# EAGLE design IrDA Contador v1.0 (EAGLE 7.5.0)
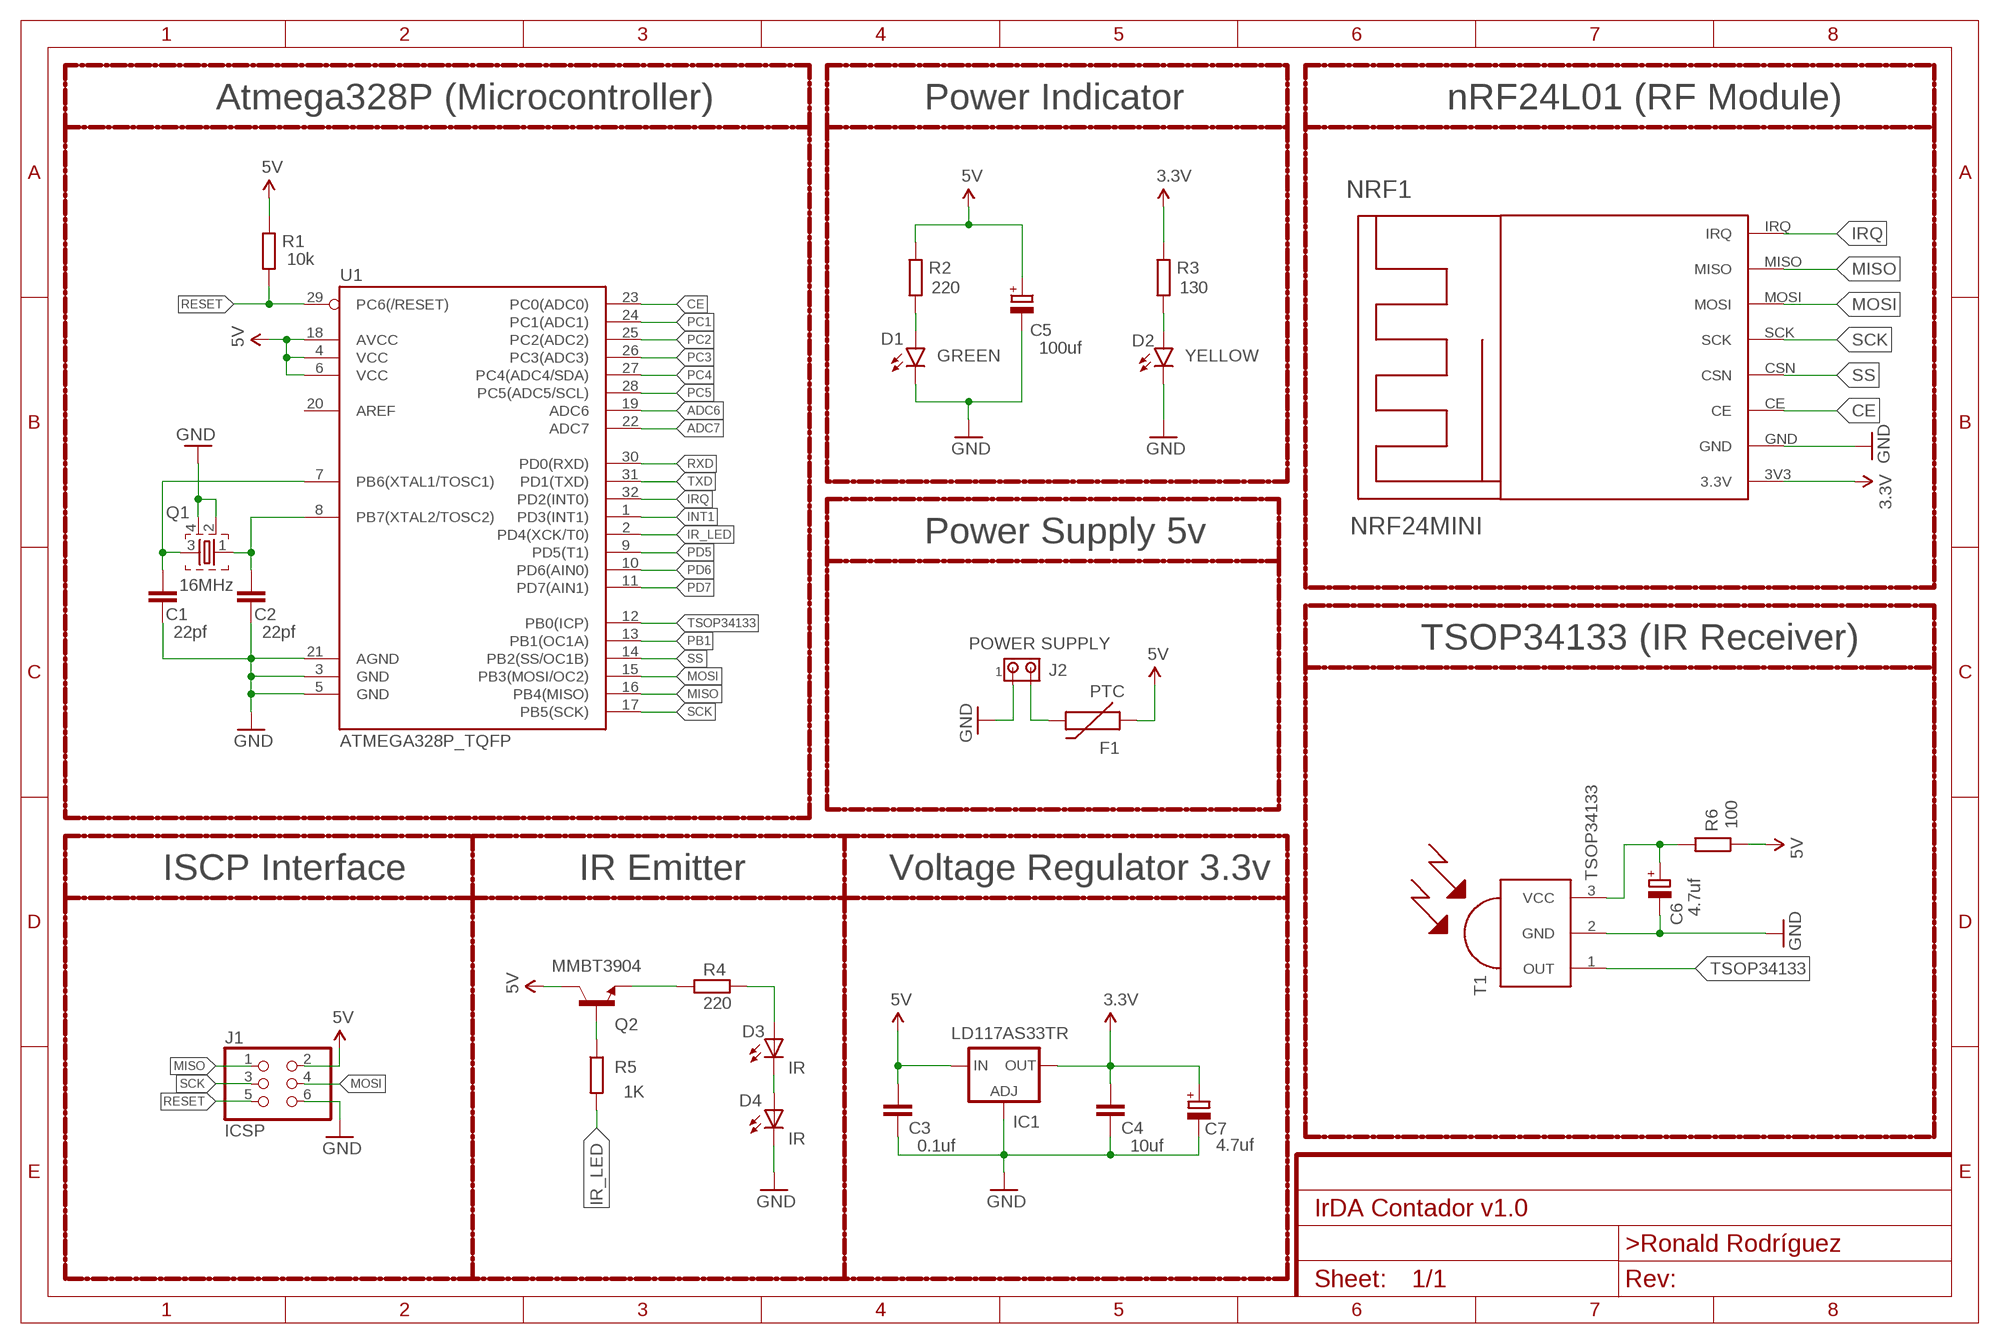
[diagram p0: schematic, sheet 1]

## Parts
C1  22pf  C-EUC0603  [C0603]
C2  22pf  C-EUC0603  [C0603]
C3  0.1uf  C-EUC0603  [C0603]
C4  10uf  C-EUC0603  [C0603]
C5  100uf  CPOL-EU153CLV-0605  [153CLV-0605]
C6  4.7uf  CPOL-EUSMCA  [SMC_A]
C7  4.7uf  CPOL-EUSMCA  [SMC_A]
D1  GREEN  LED-BLUE0603  [LED-0603]
D2  YELLOW  LED-GREEN0603  [LED-0603]
D3  IR  LED5MM  [LED5MM]
D4  IR  LED5MM  [LED5MM]
F1  PTC  PTC0603  [0603]
IC1  LD117AS33TR  [SOT223]
J1  ICSP  PINHD-2X3  [2X03]
J2  POWER SUPPLY  MTA02-156  [1X2MTA]
NRF1  NRF24MINI  [NRF24MINI]
Q1  16MHz  FA-20H  [FA-20H]
Q2  MMBT3904  TRANSISTOR_NPNMMBT2222A  [SOT23-3]
R1  10k  R-EU_R0603  [R0603]
R2  220  R-EU_R0603  [R0603]
R3  130  R-EU_R0603  [R0603]
R4  220  R-EU_R0603  [R0603]
R5  1K  R-EU_R0603  [R0603]
R6  100  R-EU_R0603  [R0603]
T1  TSOP34133  [TSOP34133]
U1  ATMEGA328P_TQFP  [TQFP32-08]

## Nets
3.3V: C4.2 C7.+ IC1.4(OUT) NRF1.3V3(3.3V) R3.2
5V: C3.2 C5.+ F1.1 IC1.3(IN) J1.2 Q2.3(C) R1.2 R2.2 R6.1 U1.4(VCC) U1.6(VCC) U1.18(AVCC)
ADC6: U1.19(ADC6)
ADC7: U1.22(ADC7)
CE: NRF1.CE U1.23(PC0(ADC0))
GND: C1.1 C2.1 C3.1 C4.1 C5.- C6.- C7.- D1.C D2.C D4.K(C) IC1.1(ADJ) J1.6 J2.1 NRF1.GND Q1.2 Q1.4 T1.2(GND) U1.3(GND) U1.5(GND) U1.21(AGND)
INT1: U1.1(PD3(INT1))
IR_LED: R5.2 U1.2(PD4(XCK/T0))
IRQ: NRF1.IRQ U1.32(PD2(INT0))
MISO: J1.1 NRF1.MISO U1.16(PB4(MISO))
MOSI: J1.4 NRF1.MOSI U1.15(PB3(MOSI/OC2))
N$1: D2.A R3.1
N$2: C1.2 Q1.3 U1.7(PB6(XTAL1/TOSC1))
N$3: C2.2 Q1.1 U1.8(PB7(XTAL2/TOSC2))
N$4: D1.A R2.1
N$5: Q2.2(E) R4.2
N$6: D3.A R4.1
N$7: D3.K(C) D4.A
N$8: C6.+ R6.2 T1.3(VCC)
N$9: F1.2 J2.2
N$10: Q2.1(B) R5.1
PB1: U1.13(PB1(OC1A))
PC1: U1.24(PC1(ADC1))
PC2: U1.25(PC2(ADC2))
PC3: U1.26(PC3(ADC3))
PC4: U1.27(PC4(ADC4/SDA))
PC5: U1.28(PC5(ADC5/SCL))
PD5: U1.9(PD5(T1))
PD6: U1.10(PD6(AIN0))
PD7: U1.11(PD7(AIN1))
RESET: J1.5 R1.1 U1.29(PC6(/RESET))
RXD: U1.30(PD0(RXD))
SCK: J1.3 NRF1.SCK U1.17(PB5(SCK))
SS: NRF1.CSN U1.14(PB2(SS/OC1B))
TSOP34133: T1.1(OUT) U1.12(PB0(ICP))
TXD: U1.31(PD1(TXD))
Unconnected: U1.20(AREF)

## Notes on the sheet
- Atmega328P (Microcontroller) | Power Indicator | nRF24L01 (RF Module)
- Power Supply 5v
- TSOP34133 (IR Receiver)
- ISCP Interface | IR Emitter | Voltage Regulator 3.3v

## Library data of the parts
C1-C4 = rcl:C-EU: CAPACITOR, European symbol
C5 = rcl:CPOL-EU: POLARIZED CAPACITOR, European symbol
C6 C7 = resistor:CPOL-EU: POLARIZED CAPACITOR, European symbol
D1 = SparkFun-LED:LED-BLUE: Blue LEDs for production use Various blue LEDs stocked by SparkFun production 0603 - DIO-08575 Rebel - DIO-09553 1206 - DIO-09911; PROD_ID: DIO-08575; VALUE: BLUE
D2 = SparkFun-LED:LED-GREEN: Various green LEDs Green LEDs used in SFE Production 0603- DIO-00821 LARGE- DIO-00862 LILYPAD- DIO-09910; PROD_ID: DIO-00821; VALUE: GREEN
D3 D4 = led:LED: LED OSRAM: - CHIPLED LG R971, LG N971, LY N971, LG Q971, LY Q971, LO R971, LY R971 LH N974, LH R974 LS Q976, LO Q976, LY Q976 LO Q996 - Hyper CHIPLED LW Q18S LB Q993, LB Q99A, LB R99A - SideLED LS A670, LO A670, LY A670, LG A670, LP A670 LB A673, LV A673, LT A673, LW A673 LH A674 LY A675 LS A676, LA A676, LO A676, LY A676, LW A676 LS A679, LY A679, LG A679 - Hyper Micro SIDELED® LS Y876, LA Y876, LO Y876, LY Y876 LT Y87S - SmartLED LW L88C, LW L88S LB L89C, LB L89S, LG L890 LS L89K, LO L89K, LY L89K LS L896, LA L896, LO L896, LY L896 - TOPLED LS T670, LO T670, LY T670, LG T670, LP T670 LSG T670, LSP T670, LSY T670, LOP T670, LYG T670 LG T671, LOG T671, LSG T671 LB T673, LV T673, LT T673, LW T673 LH T674 LS T676, LA T676, LO T676, LY T676, LB T676, LH T676, LSB T676, LW T676 LB T67C, LV T67C, LT T67C, LS T67K, LO T67K, LY T67K, LW E67C LS E67B, LA E67B, LO E67B, LY E67B, LB E67C, LV E67C, LT E67C LW T67C LS T679, LY T679, LG T679 LS T770, LO T770, LY T770, LG T770, LP T770 LB T773, LV T773, LT T773, LW T773 LH T774 LS E675, LA E675, LY E675, LS T675 LS T776, LA T776, LO T776, LY T776, LB T776 LHGB T686 LT T68C, LB T68C - Hyper Mini TOPLED® LB M676 - Mini TOPLED Santana® LG M470 LS M47K, LO M47K, LY M47K Source: http://www.osram.convergy.de LUXEON: - LUMILED® LXK2-PW12-R00, LXK2-PW12-S00, LXK2-PW14-U00, LXK2-PW14-V00 LXK2-PM12-R00, LXK2-PM12-S00, LXK2-PM14-U00 LXK2-PE12-Q00, LXK2-PE12-R00, LXK2-PE12-S00, LXK2-PE14-T00, LXK2-PE14-U00 LXK2-PB12-K00, LXK2-PB12-L00, LXK2-PB12-M00, LXK2-PB14-N00, LXK2-PB14-P00, LXK2-PB14-Q00 LXK2-PR12-L00, LXK2-PR12-M00, LXK2-PR14-Q00, LXK2-PR14-R00 LXK2-PD12-Q00, LXK2-PD12-R00, LXK2-PD12-S00 LXK2-PH12-R00, LXK2-PH12-S00 LXK2-PL12-P00, LXK2-PL12-Q00, LXK2-PL12-R00 Source: www.luxeon.com KINGBRIGHT: KA-3528ASYC Source: www.kingbright.com
F1 = SparkFun-PowerIC:PTC: Resettable Fuse PTC Resettable Fuse. Spark Fun Electronics SKU : COM-08357
IC1 = v-reg:LD117A?*: Low drop fixed and adjustable positive voltage regulators 1 A Source: http://www.st.com/stonline/products/literature/ds/7194/ld1117axx.pdf
J1 = SparkFun-Connectors:PINHD-2X3: PIN HEADER
J2 = con-amp:MTA02-156: AMP connector
NRF1 = nrf24mini:NRF24MINI
Q1 = crystal:FA-: MHz RANGE CRYSTAL UNIT Source: Epson Toyocom
Q2 = SparkFun-DiscreteSemi:TRANSISTOR_NPN: Generic NPN BJT MMBT2222A - TRANS-08049 (SOT-23, 1A 40V) MPSA42 - TRANS-09116 (SOT-23, 500mA 300V) MMBT5088LT1G - TRANS-11160 (SOT-23, 50 mA 30V) BC547 - COM-08928 <http://www.sparkfun.com/products/8928> (TO-92 45V 100mA) (1.Collector 2.Base 3.Emitter) 2N3904 - COM-00521 <http://www.sparkfun.com/products/521> (TO-92 40V 200mA) (1.Emitter 2.Base 3.Collector) P2N2222A - COM-12852 <http://www.sparkfun.com/products/12852> (TO-92 40V 600mA) (1.Collector 2.Base 3.Emitter); PROD_ID: TRANS-08049; VALUE: MMBT2222A
R1-R6 = rcl:R-EU_: RESISTOR, European symbol
T1 = tsop34133:TSOP34133: IR receiver modules for infrared remote control systems
U1 = SparkFun-DigitalIC:ATMEGA328P_TQFP; PROD_ID: IC-09069

## Board
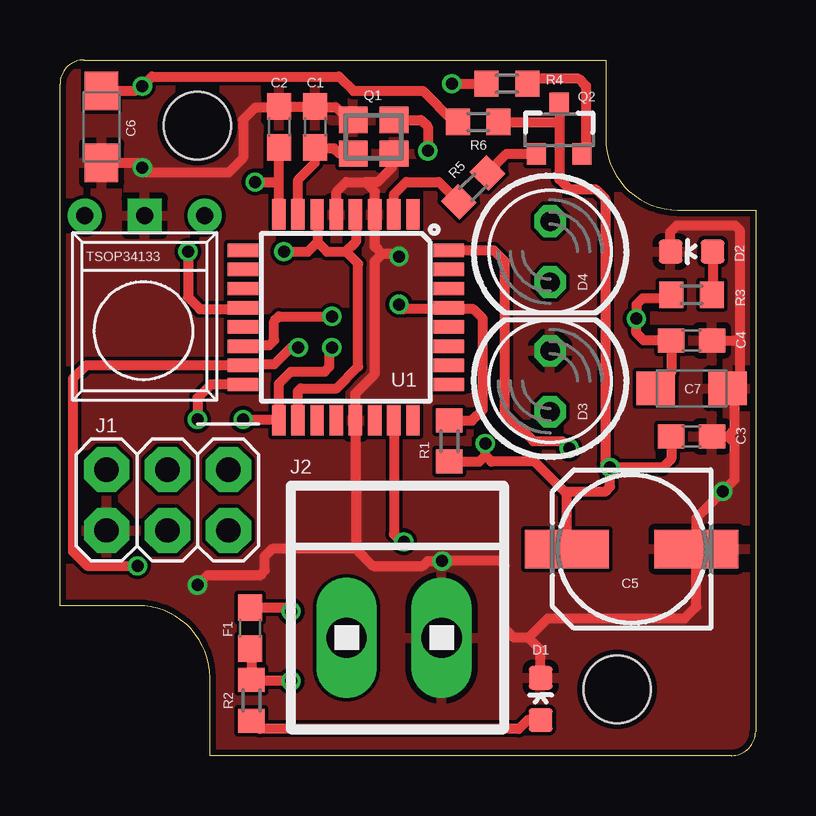
[diagram p1: board, top side]
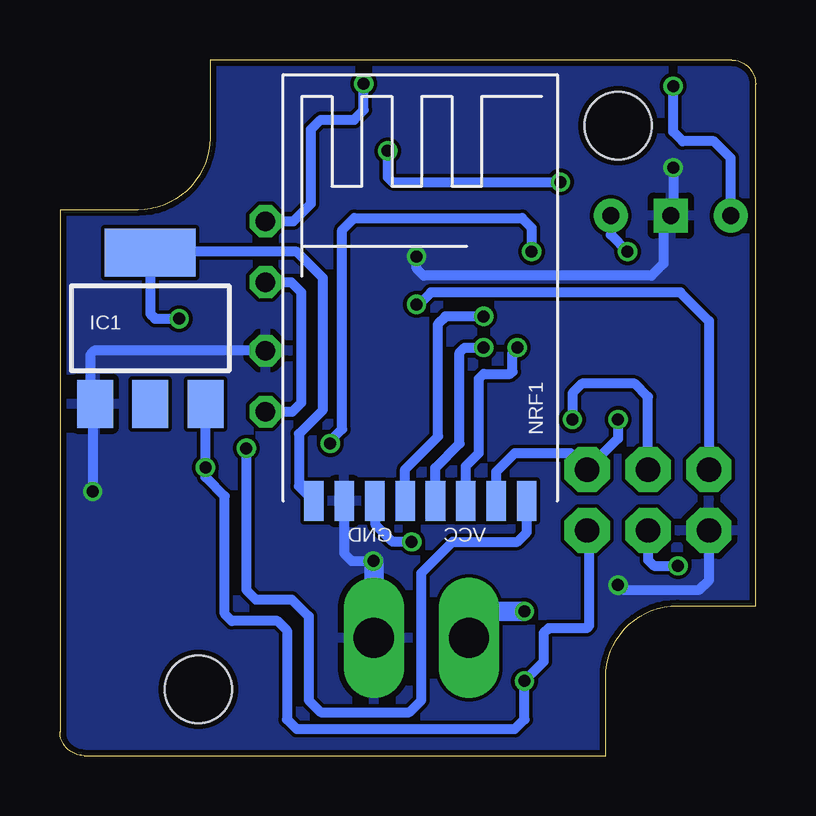
[diagram p2: board, bottom side, seen from below]

Size 29 x 29 mm. Coordinates in mm from the lower left corner, seen from the top.
Outline: 22.75,29 22.75,25.75 arc90 25.75,22.75 29,22.75 29,1 arc-90 28,0 6.25,0 6.25,3.25 arc90 3.25,6.25 0,6.25 0,28 arc-90 1,29 22.75,29
Copper layers (1*16): Top 0.035mm / dielectric 1.5mm / Bottom 0.035mm
Design rules "SeeedStudio_2layer_DRU": minimum track width 6mil, minimum drill 12mil, track to track 6mil, track to pad 6mil, pad to pad 6mil, via to via 6mil, smd to smd 0mil, copper to edge 10mil, drill to drill 10mil, minimum pad ring 10mil, minimum via ring 6mil, stop-mask expansion 2mil, vias tented up to drill 100mil, thermal gap 10mil
Holes 2.8 mm at 5.73,26.26 23.23,2.76

### Footprints (pad centres in the part's own frame; a part is rotated, then mirrored left to right if it is on the bottom)
C0603 = smd 1.1 x 1: 1 -0.85,0; 2 0.85,0
153CLV-0605 = smd 3.5 x 1.6: + 2.7,0; - -2.7,0
SMC_A = smd 1.6 x 1.4: + -1.5,0; - 1.5,0
LED-0603 = smd 1 x 1: A 0,-0.877; C 0,0.877
LED5MM = drill 0.813 octagon: A -1.27,0; K 1.27,0
0603 = smd 1.1 x 1: 1 -0.85,0; 2 0.85,0
SOT223 = smd 1.5 x 2: 1 -2.3,-3.15; 2 0,-3.15; 3 2.3,-3.15 | smd 3.8 x 2: 4 0,3.15
2X03 = drill 1.016 pad 1.88 octagon: 1 -2.54,-1.27; 2 -2.54,1.27; 3 0,-1.27; 4 0,1.27; 5 2.54,-1.27; 6 2.54,1.27
1X2MTA = drill 1.676 long: 1 1.981,0; 2 -1.981,0
NRF24MINI = smd 1.676 x 0.813: 3V3 0,8.89; CE 0,6.35; CSN 0,5.08; GND 0,7.62; IRQ 0,0; MISO 0,1.27; MOSI 0,2.54; SCK 0,3.81
FA-20H = smd 1.2 x 1.1: 1 -0.85,-0.7; 2 0.85,-0.7; 3 0.85,0.7; 4 -0.85,0.7
SOT23-3 = smd 0.8 x 0.9: 1 -0.95,-1; 2 0.95,-1; 3 0,1.1
R0603 = smd 1 x 1.1: 1 -0.85,0; 2 0.85,0
TSOP34133 = drill 0.7 pad 1.422: 1 -2.5,-4.8; 3 2.5,-4.8 | drill 0.7 pad 1.422 square: 2 0,-4.8
TQFP32-08 = smd 1.27 x 0.559: 1 -4.293,2.8; 2 -4.293,2; 3 -4.293,1.2; 4 -4.293,0.4; 5 -4.293,-0.4; 6 -4.293,-1.2; 7 -4.293,-2; 8 -4.293,-2.8; 17 4.293,-2.8; 18 4.293,-2; 19 4.293,-1.2; 20 4.293,-0.4; 21 4.293,0.4; 22 4.293,1.2; 23 4.293,2; 24 4.293,2.8 | smd 0.559 x 1.27: 9 -2.8,-4.293; 10 -2,-4.293; 11 -1.2,-4.293; 12 -0.4,-4.293; 13 0.4,-4.293; 14 1.2,-4.293; 15 2,-4.293; 16 2.8,-4.293; 25 2.8,4.293; 26 2,4.293; 27 1.2,4.293; 28 0.4,4.293; 29 -0.4,4.293; 30 -1.2,4.293; 31 -2,4.293; 32 -2.8,4.293

### Placement (x,y rotation side)
C1  10.63,26.21 270 top
C2  9.13,26.21 270 top
C3  26.33,13.31 180 top
C4  26.33,17.31 180 top
C5  23.83,8.61 180 top
C6  1.73,26.21 270 top
C7  26.33,15.31 0 top
D1  20.04,2.36 0 top
D2  26.33,21.01 90 top
D3  20.43,21.01 270 top
D4  20.43,15.61 90 top
F1  7.93,5.31 90 top
IC1  25.23,17.81 0 bottom
J1  4.48,10.65 180 top
J2  13.93,4.91 0 top
NRF1  9.53,10.61 90 bottom
Q1  13.08,25.79 180 top
Q2  20.81,26.09 0 top
R1  16.23,13.11 270 top
R2  7.98,2.3 90 top
R3  26.33,19.21 180 top
R4  18.63,28.01 0 top
R5  17.22,23.69 225 top
R6  17.43,26.41 180 top
T1  3.53,17.71 180 top
U1  11.92,18.27 270 top

### Tracks (layer width: path | path; a pad name or v marks a point on that pad's centre or on a via)
3.3V  (via drill 0.5)
  Top 0.406: R3.2 25.43,19.06 24.28,19.06 24.03,18.81 v24.03,18.21 24.03,17.61 24.33,17.31 C4.2 25.48,15.96 C7.+
  Bottom 0.406: NRF1.3V3 19.03,11.22 19.03,13.41 18.03,14.41 18.03,19.91 19.13,21.01 24.98,21.01 IC1.4 25.23,18.41 25.03,18.21 v24.03,18.21
5V  (via drill 0.5)
  Top 0.406: U1.4 12.33,21.41 11.93,21.01 | 21.03,11.01 22.73,11.01 22.93,11.21 v22.93,12.01 | C3.2 25.48,12.36 25.13,12.01 v22.93,12.01 | Q2.3 20.81,26.41 | 20.81,26.41 20.81,24.03 21.23,23.61 22.33,23.61 22.73,23.21 22.73,12.21 v22.93,12.01 | U1.18 9.92,15.2 10.03,15.31 11.53,15.31 12.43,16.21 12.43,20.51 11.93,21.01 | 21.03,11.01 19.78,12.26 17.98,12.26 17.73,12.51 | C5.+ 21.13,10.91 21.03,11.01 | R1.2 17.48,12.26 17.73,12.51 | 17.73,12.51 v17.73,13.01 | 7.93,3.3 R2.2 | F1.1 7.98,4.41 R2.2 | 8.04,3.31 R2.2 | 9.13,21.01 v9.33,21.01 10.33,21.01 10.73,21.41 | U1.6 10.73,21.41 | 10.73,21.41 11.13,21.01 11.93,21.01 | R6.1 20.81,26.41 | v9.63,3.11 8.03,3.11 R2.2
  Bottom 0.406: IC1.3 v22.93,12.01 22.93,11.61 22.13,10.81 22.13,5.91 21.83,5.61 19.93,5.61 19.53,5.21 19.53,1.51 19.13,1.11 10.03,1.11 9.63,1.51 v9.63,3.11 8.83,3.91 8.83,5.11 8.63,5.31 7.03,5.31 6.93,5.41 6.93,9.3 J1.2 | v17.73,13.01 17.73,13.11 17.23,13.61 17.23,21.91 16.73,22.41 9.73,22.41 9.33,22.01 v9.33,21.01
CE  (via drill 0.5)
  Top 0.406: 13.93,13.99 U1.23 13.92,9.22 14.23,8.91 v14.33,8.91
  Bottom 0.406: v14.33,8.91 15.13,8.91 15.83,9.61 15.83,10.56 NRF1.CE
GND  (via drill 0.5)
  Top 0.406: D2.C 25.46,21.83 25.73,22.11 28.13,22.11 28.33,21.91 28.33,17.31 | 12.33,8.61 12.33,8.81 U1.21 12.32,15.1 13.13,15.91 13.13,20.61 13.43,20.91 | 12.33,8.61 13.03,7.91 15.13,7.91 15.33,8.11 v15.93,8.11 18.33,8.11 18.53,7.91 18.53,5.31 18.93,4.92 19.54,4.92 | 19.54,4.92 20.33,5.71 26.03,5.71 26.53,6.21 C5.- 26.53,9.91 v27.63,11.01 28.13,11.51 28.13,13.01 27.83,13.31 | C6.- 3.23,24.71 v3.43,24.51 3.63,24.31 7.03,24.31 7.63,24.91 7.63,26.51 8.13,27.01 9.08,27.01 C2.1 C1.1 10.68,27.01 11.53,27.01 12.05,26.49 Q1.2 | D1.C 20.04,4.42 19.54,4.92 | 12.33,8.61 8.83,8.61 8.53,8.31 8.53,7.71 8.33,7.51 6.13,7.51 v5.73,7.11 | v14.13,20.81 14.03,20.91 13.43,20.91 | U1.5 11.53,22.58 11.53,23.51 11.93,23.91 12.73,23.91 | 12.73,23.91 13.12,23.52 U1.3 13.13,21.21 13.43,20.91 | 12.73,23.91 13.23,23.91 13.83,24.51 13.83,25 Q1.4 | 28.33,17.31 28.33,15.81 C7.- 28.13,15.01 28.13,13.61 27.83,13.31 | C3.1 27.83,13.31 | C4.1 28.33,17.31
  Bottom 0.406: v27.63,11.01 27.63,14.36 IC1.1 27.73,14.66 27.73,16.71 27.56,16.88 D4.K | NRF1.GND 17.15,8.43 16.83,8.11 v15.93,8.11 15.91,8.09 | v3.43,24.51 3.43,22.61 T1.2 3.83,22.21 3.83,20.51 4.33,20.01 13.83,20.01 14.13,20.31 v14.13,20.81 | v5.73,7.11 5.53,6.91 2.33,6.91 1.93,7.31 J1.6
  Bottom 0.813: J2.1 15.91,8.09
  pour Bottom: 0.93,29.01 22.73,29.01 22.73,28.01 22.73,25.81 22.73,25.61 arc90 25.53,22.81 28.93,22.81 28.93,1.21 arc-90 27.73,0.01 6.23,0.01 6.23,3.21 arc90 3.13,6.31 0.03,6.31 -0.07,6.31 -0.07,28.01 arc-90
  pour Top: 0.93,29.01 22.73,29.01 22.73,25.81 arc90 25.73,22.81 29.03,22.81 29.03,1.01 arc-90 28.03,0.01 6.23,0.01 6.23,3.31 arc90 3.33,6.21 0.03,6.21 0.03,28.11 arc-90
IR_LED
  Top 0.406: U1.2 13.93,22.58 13.93,23.41 14.43,23.91 15.8,23.91 R5.2
IRQ  (via drill 0.5)
  Top 0.406: U1.32 18.07,21.07 18.53,20.61 18.53,14.31 19.73,13.11 20.93,13.11 v21.23,12.81
  Bottom 0.406: v21.23,12.81 21.23,6.91 20.83,6.51 19.33,6.51 18.63,5.81 18.63,2.31 18.13,1.81 14.43,1.81 13.93,2.31 13.93,7.61 12.63,8.91 9.93,8.91 9.53,9.31 NRF1.IRQ
MISO  (via drill 0.5)
  Top 0.406: U1.16 6.29,15.47 5.73,14.91 v5.73,14.01
  Bottom 0.406: NRF1.MISO 10.8,11.84 10.03,12.61 7.71,12.61 J1.1 5.73,13.21 v5.73,14.01
MOSI  (via drill 0.5)
  Top 0.406: 7.69,16.21 U1.15 | 7.57,16.21 U1.15 | U1.15 1.09,16.27 0.53,15.71 0.53,8.51 1.13,7.91 v3.23,7.91 | U1.15 7.67,16.31 8.93,16.31 9.63,17.01 v9.93,17.01
  Bottom 0.406: NRF1.MOSI 12.07,12.07 11.53,12.61 11.53,15.71 11.33,15.91 10.23,15.91 10.13,16.01 10.13,16.81 v9.93,17.01 | J1.4 4.48,8.16 4.23,7.91 v3.23,7.91
N$1
  Top 0.406: 27.41,19.44 R3.1 27.21,19.14 D2.A
N$2
  Top 0.406: U1.7 9.93,22.58 9.93,24.01 10.63,24.71 C1.2 10.68,25.31 11.43,25.31 11.65,25.09 Q1.3
N$3  (via drill 0.5)
  Top 0.406: 9.13,22.58 U1.8 9.12,23.91 | C2.2 9.12,25.35 9.12,23.91 | Q1.1 15.05,26.49 15.33,26.21 v15.33,25.21 | v8.13,23.91 9.12,23.91
  Bottom 0.406: v15.33,25.21 15.33,24.11 15.13,23.91 v8.13,23.91
N$4
  Top 0.406: D1.A 19.51,1.48 19.13,1.11 8.33,1.11 R2.1
N$5
  Top 0.406: Q2.2 21.93,25.26 21.93,27.91 21.63,28.21 19.68,28.21 R4.2
N$6  (via drill 0.5)
  Top 0.406: v16.33,28.01 R4.1
  Bottom 0.406: D3.A 19.26,22.28 18.53,23.01 18.53,26.11 18.13,26.51 16.73,26.51 16.33,26.91 v16.33,28.01
N$7
  Bottom 0.406: D4.A 19.3,14.34 18.93,14.71 18.93,19.31 19.36,19.74 D3.K
N$8  (via drill 0.5)
  Top 0.406: C6.+ 3.13,27.71 v3.43,27.91 3.83,28.31 11.63,28.31 12.23,27.71 15.13,27.71 16.43,26.41 R6.2
  Bottom 0.406: T1.3 1.03,24.91 1.73,25.61 3.03,25.61 3.43,26.01 v3.43,27.91
N$9  (via drill 0.5)
  Top 0.406: v9.63,6.01 9.48,6.16 F1.2
  Bottom 0.813: J2.2 10.85,6.01 v9.63,6.01
N$10
  Top 0.406: R5.1 18.62,25.09 Q2.1
RESET  (via drill 0.5)
  Top 0.305: 16.15,18.61 U1.29
  Top 0.406: R1.1 17.18,13.96 17.63,14.41 17.63,18.21 17.23,18.61 16.27,18.61 U1.29 | 16.15,18.61 14.33,18.61 v14.13,18.81
  Bottom 0.406: v14.13,18.81 14.03,18.81 13.53,19.31 3.13,19.31 1.94,18.12 J1.5
SCK  (via drill 0.5)
  Top 0.406: v7.63,14.01 9.09,14.01 U1.17 9.13,13.99 9.13,15.51 9.63,16.01 11.03,16.01 11.23,16.21 11.23,16.91 v11.33,17.01
  Bottom 0.406: NRF1.SCK 13.34,12 12.33,13.01 12.33,16.81 12.13,17.01 v11.33,17.01 | J1.3 4.48,14.96 5.03,15.51 7.23,15.51 7.63,15.11 v7.63,14.01
SS  (via drill 0.5)
  Top 0.406: U1.14 7.67,17.11 8.73,17.11 8.93,17.31 8.93,18.11 9.13,18.31 v11.33,18.31
  Bottom 0.406: NRF1.CSN 14.61,11.93 13.23,13.31 13.23,18.01 12.93,18.31 v11.33,18.31
TSOP34133  (via drill 0.5)
  Top 0.406: v5.33,21.01 5.33,19.11 5.83,18.61 7.57,18.61 U1.12
  Bottom 0.406: T1.1 6.03,21.71 v5.33,21.01

### Text on the board
bNames: VCC | GND